# Altium schematic sheet Signal_and_supply.SchDoc
size A4; SheetNumber: 2; SheetTotal: 2
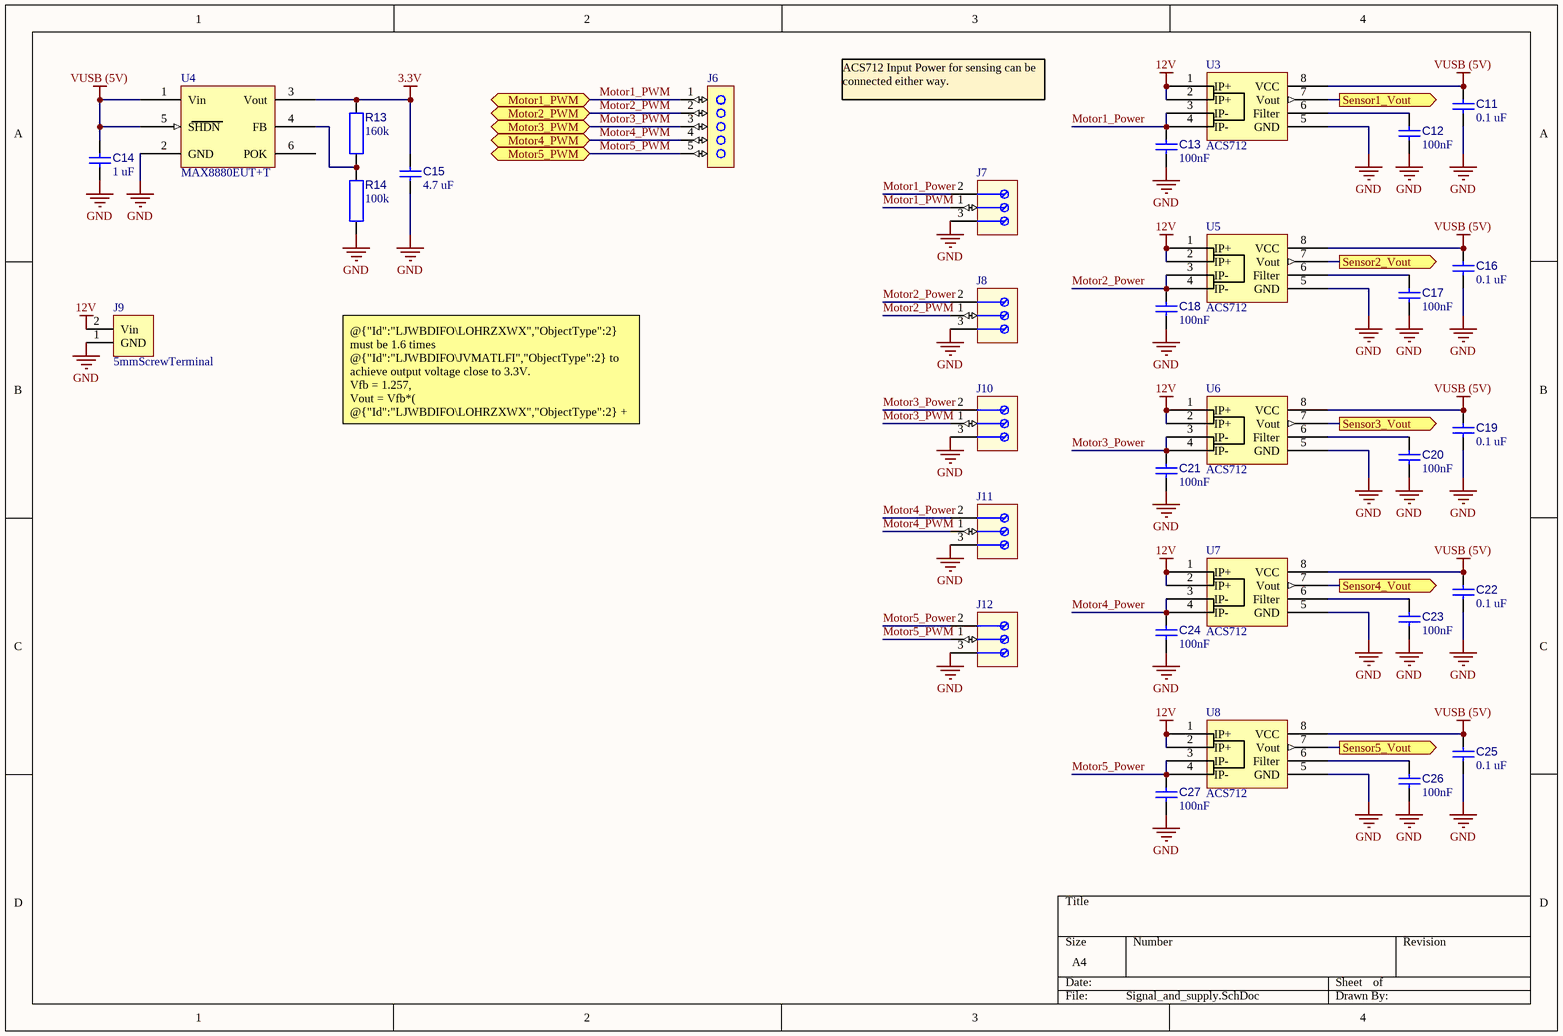
[diagram p0: Signal_and_supply.SchDoc]

## Parts
C11  Capacitance: 0.1 uF  [CAPC1608X08N]  (hidden comment: Capacitor 0603 generic)
C12  value 100nF  [CAPC1608X90X40NL10T20]  (hidden comment: Capacitor 100 nF +/-10% 50 V 0603)
C13  value 100nF  [CAPC1608X90X40NL10T20]  (hidden comment: Capacitor 100 nF +/-10% 50 V 0603)
C14  Capacitance: 1 uF  [CAPC1608X08N]  (hidden comment: Capacitor 0603 generic)
C15  Capacitance: 4.7 uF  [CAPC1608X08N]  (hidden comment: Capacitor 0603 generic)
C16  Capacitance: 0.1 uF  [CAPC1608X08N]  (hidden comment: Capacitor 0603 generic)
C17  value 100nF  [CAPC1608X90X40NL10T20]  (hidden comment: Capacitor 100 nF +/-10% 50 V 0603)
C18  value 100nF  [CAPC1608X90X40NL10T20]  (hidden comment: Capacitor 100 nF +/-10% 50 V 0603)
C19  Capacitance: 0.1 uF  [CAPC1608X08N]  (hidden comment: Capacitor 0603 generic)
C20  value 100nF  [CAPC1608X90X40NL10T20]  (hidden comment: Capacitor 100 nF +/-10% 50 V 0603)
C21  value 100nF  [CAPC1608X90X40NL10T20]  (hidden comment: Capacitor 100 nF +/-10% 50 V 0603)
C22  Capacitance: 0.1 uF  [CAPC1608X08N]  (hidden comment: Capacitor 0603 generic)
C23  value 100nF  [CAPC1608X90X40NL10T20]  (hidden comment: Capacitor 100 nF +/-10% 50 V 0603)
C24  value 100nF  [CAPC1608X90X40NL10T20]  (hidden comment: Capacitor 100 nF +/-10% 50 V 0603)
C25  Capacitance: 0.1 uF  [CAPC1608X08N]  (hidden comment: Capacitor 0603 generic)
C26  value 100nF  [CAPC1608X90X40NL10T20]  (hidden comment: Capacitor 100 nF +/-10% 50 V 0603)
C27  value 100nF  [CAPC1608X90X40NL10T20]  (hidden comment: Capacitor 100 nF +/-10% 50 V 0603)
J6  Header-2.54-ZL201-05G  [Header-2.54-ZL201-05G-Footprint-1]  (value not drawn)
J7  691103110003  [691103110003]  (value not drawn)
J8  691103110003  [691103110003]  (value not drawn)
J9  5mmScrewTerminal  [5mmScrewTerminal-Footprint-1]
J10  691103110003  [691103110003]  (value not drawn)
J11  691103110003  [691103110003]  (value not drawn)
J12  691103110003  [691103110003]  (value not drawn)
R13  Resistance: 160k  [RESC1608X04N]  (hidden comment: Resistor 0603 generic)
R14  Resistance: 100k  [RESC1608X04N]  (hidden comment: Resistor 0603 generic)
U3  ACS712  [SOIC127P600X175-8N]
U4  MAX8880EUT+T  [SOT95P280X145-6N]
U5  ACS712  [SOIC127P600X175-8N]
U6  ACS712  [SOIC127P600X175-8N]
U7  ACS712  [SOIC127P600X175-8N]
U8  ACS712  [SOIC127P600X175-8N]

## Ports
Motor1_PWM (bidir, see MCU[2B]), Motor2_PWM (bidir, see MCU[2B]), Motor3_PWM (bidir, see MCU[2B]), Motor4_PWM (bidir, see MCU[2A]), Motor5_PWM (bidir, see MCU[2A]), Sensor1_Vout (out, see MCU[1A]), Sensor2_Vout (out, see MCU[1A]), Sensor3_Vout (out, see MCU[1A]), Sensor4_Vout (out, see MCU[1A]), Sensor5_Vout (out, see MCU[1A])

## Nets
3.3V: C15.1 R13.1 U4.3(Vout)
12V: J9.2(Vin) U3.1(IP+) U3.2(IP+) U5.1(IP+) U5.2(IP+) U6.1(IP+) U6.2(IP+) U7.1(IP+) U7.2(IP+) U8.1(IP+) U8.2(IP+)
GND: C11.2 C12.1 C13.1 C14.1 C15.2 C16.2 C17.1 C18.1 C19.2 C20.1 C21.1 C22.2 C23.1 C24.1 C25.2 C26.1 C27.1 J7.3(GND) J8.3(GND) J9.1(GND) J10.3(GND) J11.3(GND) J12.3(GND) R14.2 U3.5(GND) U4.2(GND) U5.5(GND) U6.5(GND) U7.5(GND) U8.5(GND)
VUSB (5V): C11.1 C14.2 C16.1 C19.1 C22.1 C25.1 U3.8(VCC) U4.1(Vin) U4.5(SHDN) U5.8(VCC) U6.8(VCC) U7.8(VCC) U8.8(VCC)
Motor1_Power: C13.2 J7.2(V+) U3.3(IP-) U3.4(IP-)
Motor1_PWM: J6.1 J7.1(PWM) ; port Motor1_PWM
Motor2_Power: C18.2 J8.2(V+) U5.3(IP-) U5.4(IP-)
Motor2_PWM: J6.2 J8.1(PWM) ; port Motor2_PWM
Motor3_Power: C21.2 J10.2(V+) U6.3(IP-) U6.4(IP-)
Motor3_PWM: J6.3 J10.1(PWM) ; port Motor3_PWM
Motor4_Power: C24.2 J11.2(V+) U7.3(IP-) U7.4(IP-)
Motor4_PWM: J6.4 J11.1(PWM) ; port Motor4_PWM
Motor5_Power: C27.2 J12.2(V+) U8.3(IP-) U8.4(IP-)
Motor5_PWM: J6.5 J12.1(PWM) ; port Motor5_PWM
Sensor1_Vout: U3.7(Vout) ; port Sensor1_Vout
Sensor2_Vout: U5.7(Vout) ; port Sensor2_Vout
Sensor3_Vout: U6.7(Vout) ; port Sensor3_Vout
Sensor4_Vout: U7.7(Vout) ; port Sensor4_Vout
Sensor5_Vout: U8.7(Vout) ; port Sensor5_Vout
NetC12_2: C12.2 U3.6(Filter)
NetC17_2: C17.2 U5.6(Filter)
NetC20_2: C20.2 U6.6(Filter)
NetC23_2: C23.2 U7.6(Filter)
NetC26_2: C26.2 U8.6(Filter)
NetR13_2: R13.2 R14.1 U4.4(FB)

Not connected (* = marked no-connect by the designer): U4 6(POK)

## Notes on the sheet
- ACS712 Input Power for sensing can be connected either way.
- @{"Id":"LJWBDIFO\LOHRZXWX","ObjectType":2} must be 1.6 times @{"Id":"LJWBDIFO\JVMATLFI","ObjectType":2} to achieve output voltage close to 3.3V.
  Vfb = 1.257,
  Vout = Vfb*( @{"Id":"LJWBDIFO\LOHRZXWX","ObjectType":2} + @{"Id":"LJWBDIFO\JVMATLFI","ObjectType":2} )/ @{"Id":"LJWBDIFO\JVMATLFI","ObjectType":2} = 3.268 V.
  Settin @{"Id":"LJWBDIFO\JVMATLFI","ObjectType":2} to 1 megaohm  and calculating @{"Id":"LJWBDIFO\LOHRZXWX","ObjectType":2} would result in marginally less current consumption.

## Library data of the parts
C11 C14-C16 C19 C22 C25 = CMP-001-00083-2: Generic 0603 capacitor. No set voltage/capacitance rating.
C12 C13 C17 C18 C20 C21 C23 C24 C26 C27 = CMP-001-00017-6: Chip Capacitor, 100 nF, +/- 10%, 50 V, 0603 (1608 Metric); Voltage Rating: 50V; Capacitor Type: Ceramic; Tolerance: 10%; Mounting Technology: SM; Max Operating Temperature: 125°C; RoHS Compliant: True; Pins: 2; Case/Package: 0603; Min Operating Temperature: -55°C
J6 = CMP-00028-00007-3: Male header, pitch 2.54 mm, 1x5 pins
J7 J8 J10-J12 = CMP-00028-00008-2: Barrier Strip Terminal Block; RoHS Compliant: Yes
J9 = CMP-00028-00010-3: 16A 5 mm pitch screw terminal, 2 sockets.
R13 R14 = CMP-009-00177-2: Generic 0603 resistor, no fixed value.
U3 U5-U8 = CMP-010-00024-2: Integrated, Hall-Effect-Based Linear Current Sensor IC; Nominal Supply Current: 10mA; Max Supply Voltage: 8V; Output Current: 3mA; Min Supply Voltage: 4.5V; Nominal Supply Voltage: 5V; Sensor Type: analog current sensor; ComponentLink1URL: https://www.farnell.com/datasheets/3283075.pdf?_gl=1*655fm5*_gcl_aw*R0NMLjE3MjkyNjA3NzYuQ2p3S0NBandqc2k0QmhCNUVpd0FGQUwwWUJJQ1IwTktsZUpReWIxcFRubGxNLVh3bUhQcFctSFhLUnYtVFFUc01qMmhGYkt5YWJZdmpob0N3c0lRQXZEX0J3RQ..*_gcl_au*MTA1Mjg3ODU0LjE3Mjc3MDI1ODg.; Max Operating Temperature: 85°C; Mounting Technology: smd; Min Operating Temperature: -40°C; RoHS Compliant: yes; Pins: 8; ComponentLink1Description: Datasheet; Case/Package: SOIC8
U4 = CMP-019-00049-1: Ultra-Low-IQ, Low-Dropout Linear Regulator, output 1.25 - 5.5 V.; Max Supply Voltage: 12V; Nominal Supply Current: 3mA; Output Current: 200mA; Output Voltage: 3.3V; Min Supply Voltage: 2.5V; Dropout Voltage: 100mV; Pins: 6; Case/Package: SOT-6; Mounting Technology: smd; Min Operating Temperature: -40°C; RoHS Compliant: yes; Max Operating Temperature: 125°C